# Altium schematic sheet Instigator2012ConnectorSch.SchDoc
size Letter; DocumentNumber: 2; SheetNumber: 2; SheetTotal: 4
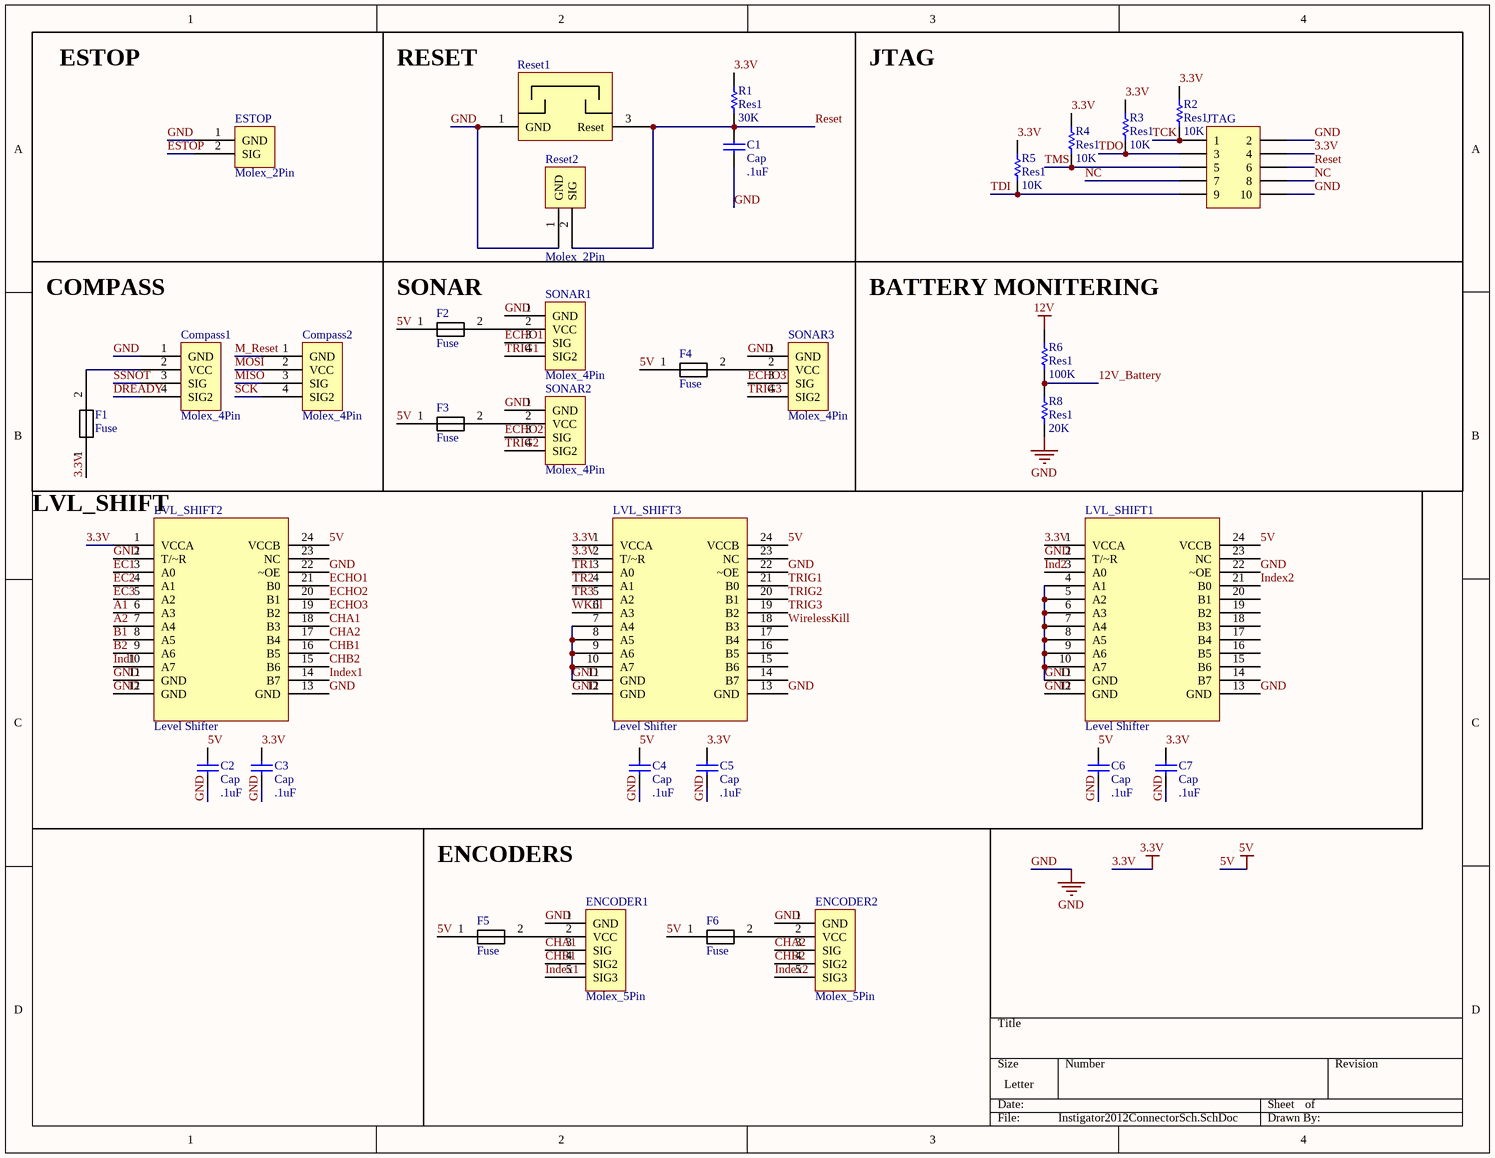
[diagram p0: Instigator2012ConnectorSch.SchDoc]

## Parts
C1  Cap  value .1uF  [1608[0603]]
C2  Cap  value .1uF  [1608[0603]]
C3  Cap  value .1uF  [1608[0603]]
C4  Cap  value .1uF  [1608[0603]]
C5  Cap  value .1uF  [1608[0603]]
C6  Cap  value .1uF  [1608[0603]]
C7  Cap  value .1uF  [1608[0603]]
Compass1  Molex_4Pin  [PCBComponent_1]
Compass2  Molex_4Pin  [PCBComponent_1]
ENCODER1  Molex_5Pin  [PCBComponent_1]
ENCODER2  Molex_5Pin  [PCBComponent_1]
ESTOP  Molex_2Pin  [PCBComponent_1]
F1  Fuse  [PCBComponent_1 - duplicate]
F2  Fuse  [PCBComponent_1 - duplicate]
F3  Fuse  [PCBComponent_1 - duplicate]
F4  Fuse  [PCBComponent_1 - duplicate]
F5  Fuse  [PCBComponent_1 - duplicate]
F6  Fuse  [PCBComponent_1 - duplicate]
JTAG  Header 5X2  [HDR2X5]  (value not drawn)
LVL_SHIFT1  Level Shifter  [TSOP65P640X110-24N]
LVL_SHIFT2  Level Shifter  [TSOP65P640X110-24N]
LVL_SHIFT3  Level Shifter  [TSOP65P640X110-24N]
R1  Res1  value 30K  [1608[0603]]
R2  Res1  value 10K  [1608[0603]]
R3  Res1  value 10K  [1608[0603]]
R4  Res1  value 10K  [1608[0603]]
R5  Res1  value 10K  [1608[0603]]
R6  Res1  value 100K  [1608[0603]]
R8  Res1  value 20K  [1608[0603]]
Reset1  l  [PCBComponent_1]  (value not drawn)
Reset2  Molex_2Pin  [PCBComponent_1]
SONAR1  Molex_4Pin  [PCBComponent_1]
SONAR2  Molex_4Pin  [PCBComponent_1]
SONAR3  Molex_4Pin  [PCBComponent_1]

## Blocks framed on the sheet
JTAG: JTAG R2-R5

## Nets
3.3V: C3.2 C5.2 C7.2 F1.1 JTAG.4 LVL_SHIFT1.1(VCCA) LVL_SHIFT2.1(VCCA) LVL_SHIFT3.1(VCCA) LVL_SHIFT3.2(T/~R) R1.2 R2.2 R3.2 R4.2 R5.2
5V: C2.2 C4.2 C6.2 F2.1 F3.1 F4.1 F5.1 F6.1 LVL_SHIFT1.24(VCCB) LVL_SHIFT2.24(VCCB) LVL_SHIFT3.24(VCCB)
12V: R6.2
GND: C1.1 C2.1 C3.1 C4.1 C5.1 C6.1 C7.1 Compass1.1(GND) ENCODER1.1(GND) ENCODER2.1(GND) ESTOP.1(GND) JTAG.2 JTAG.10 LVL_SHIFT1.2(T/~R) LVL_SHIFT1.4(A1) LVL_SHIFT1.5(A2) LVL_SHIFT1.6(A3) LVL_SHIFT1.7(A4) LVL_SHIFT1.8(A5) LVL_SHIFT1.9(A6) LVL_SHIFT1.10(A7) LVL_SHIFT1.11(GND) LVL_SHIFT1.12(GND) LVL_SHIFT1.13(GND) LVL_SHIFT1.22(~OE) LVL_SHIFT2.2(T/~R) LVL_SHIFT2.11(GND) LVL_SHIFT2.12(GND) LVL_SHIFT2.13(GND) LVL_SHIFT2.22(~OE) LVL_SHIFT3.7(A4) LVL_SHIFT3.8(A5) LVL_SHIFT3.9(A6) LVL_SHIFT3.10(A7) LVL_SHIFT3.11(GND) LVL_SHIFT3.12(GND) LVL_SHIFT3.13(GND) LVL_SHIFT3.22(~OE) R8.1 Reset1.1(GND) Reset2.1(GND) SONAR1.1(GND) SONAR2.1(GND) SONAR3.1(GND)
12V_Battery: R6.1 R8.2
A1: LVL_SHIFT2.6(A3)
A2: LVL_SHIFT2.7(A4)
B1: LVL_SHIFT2.8(A5)
B2: LVL_SHIFT2.9(A6)
CHA1: ENCODER1.3(SIG) LVL_SHIFT2.18(B3)
CHA2: ENCODER2.3(SIG) LVL_SHIFT2.17(B4)
CHB1: ENCODER1.4(SIG2) LVL_SHIFT2.16(B5)
CHB2: ENCODER2.4(SIG2) LVL_SHIFT2.15(B6)
DREADY: Compass1.4(SIG2)
EC1: LVL_SHIFT2.3(A0)
EC2: LVL_SHIFT2.4(A1)
EC3: LVL_SHIFT2.5(A2)
ECHO1: LVL_SHIFT2.21(B0) SONAR1.3(SIG)
ECHO2: LVL_SHIFT2.20(B1) SONAR2.3(SIG)
ECHO3: LVL_SHIFT2.19(B2) SONAR3.3(SIG)
ESTOP: ESTOP.2(SIG)
Ind1: LVL_SHIFT2.10(A7)
Ind2: LVL_SHIFT1.3(A0)
Index1: ENCODER1.5(SIG3) LVL_SHIFT2.14(B7)
Index2: ENCODER2.5(SIG3) LVL_SHIFT1.21(B0)
M_Reset: Compass2.1(GND)
MISO: Compass2.3(SIG)
MOSI: Compass2.2(VCC)
NC: JTAG.7 JTAG.8
Reset: C1.2 JTAG.6 R1.1 Reset1.3(Reset) Reset2.2(SIG)
SCK: Compass2.4(SIG2)
SSNOT: Compass1.3(SIG)
TCK: JTAG.1 R2.1
TDI: JTAG.9 R5.1
TDO: JTAG.3 R3.1
TMS: JTAG.5 R4.1
TR1: LVL_SHIFT3.3(A0)
TR2: LVL_SHIFT3.4(A1)
TR3: LVL_SHIFT3.5(A2)
TRIG1: LVL_SHIFT3.21(B0) SONAR1.4(SIG2)
TRIG2: LVL_SHIFT3.20(B1) SONAR2.4(SIG2)
TRIG3: LVL_SHIFT3.19(B2) SONAR3.4(SIG2)
WirelessKill: LVL_SHIFT3.18(B3)
WKill: LVL_SHIFT3.6(A3)
NetCompass1_2: Compass1.2(VCC) F1.2
NetENCODER1_2: ENCODER1.2(VCC) F5.2
NetENCODER2_2: ENCODER2.2(VCC) F6.2
NetF2_2: F2.2 SONAR1.2(VCC)
NetF3_2: F3.2 SONAR2.2(VCC)
NetF4_2: F4.2 SONAR3.2(VCC)

Not connected (* = marked no-connect by the designer): LVL_SHIFT1 14(B7) 15(B6) 16(B5) 17(B4) 18(B3) 19(B2) 20(B1) 23(NC); LVL_SHIFT2 23(NC); LVL_SHIFT3 14(B7) 15(B6) 16(B5) 17(B4) 23(NC)

## Notes on the sheet
- ESTOP
- RESET
- COMPASS
- (near F2) SONAR
- (near R6) BATTERY MONITERING
- (near LVL_SHIFT2) LVL_SHIFT
- ENCODERS

## Library data of the parts
C1-C7 = Cap: Capacitor; Published: 8-Jun-2000; LatestRevisionDate: 17-Jul-2002; LatestRevisionNote: Re-released for DXP Platform.; PackageReference: RAD-0.3; Publisher: Altium Limited; PackageDescription: Radial Cap, Thru-Hole; 2 Leads; 0.3 in Pin Spacing
JTAG = Header 5X2: Header, 5-Pin, Dual row; LatestRevisionDate: 17-Jul-2002; LatestRevisionNote: Re-released for DXP Platform.; Publisher: Altium Limited
R1-R6 R8 = Res1: Resistor; Published: 8-Jun-2000; LatestRevisionDate: 17-Jul-2002; LatestRevisionNote: Re-released for DXP Platform.; PackageReference: AXIAL-0.3; Publisher: Altium Limited; PackageDescription: Axial Device, Thru-Hole; 2 Leads; 0.3 in Pin Spacing
Reset1 = Component_1